# EAGLE schematic AVR_S1 (EAGLE 7.5.0)
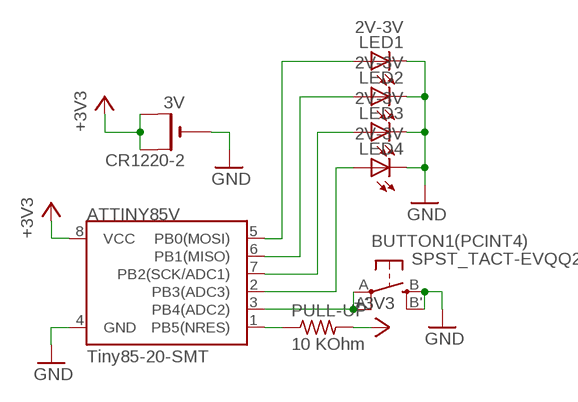
[diagram p0: schematic, sheet 1]

## Parts
ATTINY85V  Tiny85-20-SMT  ATTINY45TINY85-20-SMT  [SO08-EIAJ]
BUTTON1(PCINT4)  SPST_TACT-EVQQ2  [EVQ-Q2]
CR1220-2  3V  CR1220SMT  [CR1220-SMD]
LED1  2V-3V  LEDSML0805  [SML0805]
LED2  2V-3V  LEDSML0805  [SML0805]
LED3  2V-3V  LEDSML0805  [SML0805]
LED4  2V-3V  LEDSML0805  [SML0805]
PULL-UP  10 KOhm  R-US_M0805  [M0805]

## Nets
+3V3: ATTINY85V.8(VCC) CR1220-2.+$1(+) CR1220-2.+$2(+1) PULL-UP.2
GND: ATTINY85V.4(GND) BUTTON1(PCINT4).B'(S1) BUTTON1(PCINT4).B(S) CR1220-2.- LED1.C LED2.C LED3.C LED4.C
N$1: ATTINY85V.2(PB3(ADC3)) LED4.A
N$2: ATTINY85V.1(PB5(NRES)) PULL-UP.1
N$3: ATTINY85V.7(PB2(SCK/ADC1)) LED3.A
N$4: ATTINY85V.3(PB4(ADC2)) BUTTON1(PCINT4).A'(P1) BUTTON1(PCINT4).A(P)
N$11: ATTINY85V.5(PB0(MOSI)) LED1.A
N$12: ATTINY85V.6(PB1(MISO)) LED2.A

## Library data of the parts
ATTINY85V = SparkFun-DigitalIC:ATTINY45: Atmel 8-pin 2/4/8kB flash uC; PROD_ID: IC-09092
BUTTON1(PCINT4) = adafruit:SPST_TACT: SMT 6mm switch, EVQQ2 series http://www.ladyada.net/library/eagle
CR1220-2 = adafruit:CR1220: CR1216/CR1220/CR1225 12mm 3V lithium coin cell Great for battery packup. Both SMT and THM holders. Note the THM package has the ground pads on both sides of the PCB so that the masks are the same - this reduces the cost
LED1-LED4 = led:LED: LED OSRAM: - CHIPLED LG R971, LG N971, LY N971, LG Q971, LY Q971, LO R971, LY R971 LH N974, LH R974 LS Q976, LO Q976, LY Q976 LO Q996 - Hyper CHIPLED LW Q18S LB Q993, LB Q99A, LB R99A - SideLED LS A670, LO A670, LY A670, LG A670, LP A670 LB A673, LV A673, LT A673, LW A673 LH A674 LY A675 LS A676, LA A676, LO A676, LY A676, LW A676 LS A679, LY A679, LG A679 - Hyper Micro SIDELED® LS Y876, LA Y876, LO Y876, LY Y876 LT Y87S - SmartLED LW L88C, LW L88S LB L89C, LB L89S, LG L890 LS L89K, LO L89K, LY L89K LS L896, LA L896, LO L896, LY L896 - TOPLED LS T670, LO T670, LY T670, LG T670, LP T670 LSG T670, LSP T670, LSY T670, LOP T670, LYG T670 LG T671, LOG T671, LSG T671 LB T673, LV T673, LT T673, LW T673 LH T674 LS T676, LA T676, LO T676, LY T676, LB T676, LH T676, LSB T676, LW T676 LB T67C, LV T67C, LT T67C, LS T67K, LO T67K, LY T67K, LW E67C LS E67B, LA E67B, LO E67B, LY E67B, LB E67C, LV E67C, LT E67C LW T67C LS T679, LY T679, LG T679 LS T770, LO T770, LY T770, LG T770, LP T770 LB T773, LV T773, LT T773, LW T773 LH T774 LS E675, LA E675, LY E675, LS T675 LS T776, LA T776, LO T776, LY T776, LB T776 LHGB T686 LT T68C, LB T68C - Hyper Mini TOPLED® LB M676 - Mini TOPLED Santana® LG M470 LS M47K, LO M47K, LY M47K Source: http://www.osram.convergy.de LUXEON: - LUMILED® LXK2-PW12-R00, LXK2-PW12-S00, LXK2-PW14-U00, LXK2-PW14-V00 LXK2-PM12-R00, LXK2-PM12-S00, LXK2-PM14-U00 LXK2-PE12-Q00, LXK2-PE12-R00, LXK2-PE12-S00, LXK2-PE14-T00, LXK2-PE14-U00 LXK2-PB12-K00, LXK2-PB12-L00, LXK2-PB12-M00, LXK2-PB14-N00, LXK2-PB14-P00, LXK2-PB14-Q00 LXK2-PR12-L00, LXK2-PR12-M00, LXK2-PR14-Q00, LXK2-PR14-R00 LXK2-PD12-Q00, LXK2-PD12-R00, LXK2-PD12-S00 LXK2-PH12-R00, LXK2-PH12-S00 LXK2-PL12-P00, LXK2-PL12-Q00, LXK2-PL12-R00 Source: www.luxeon.com KINGBRIGHT: KA-3528ASYC Source: www.kingbright.com
PULL-UP = rcl:R-US_: RESISTOR, American symbol